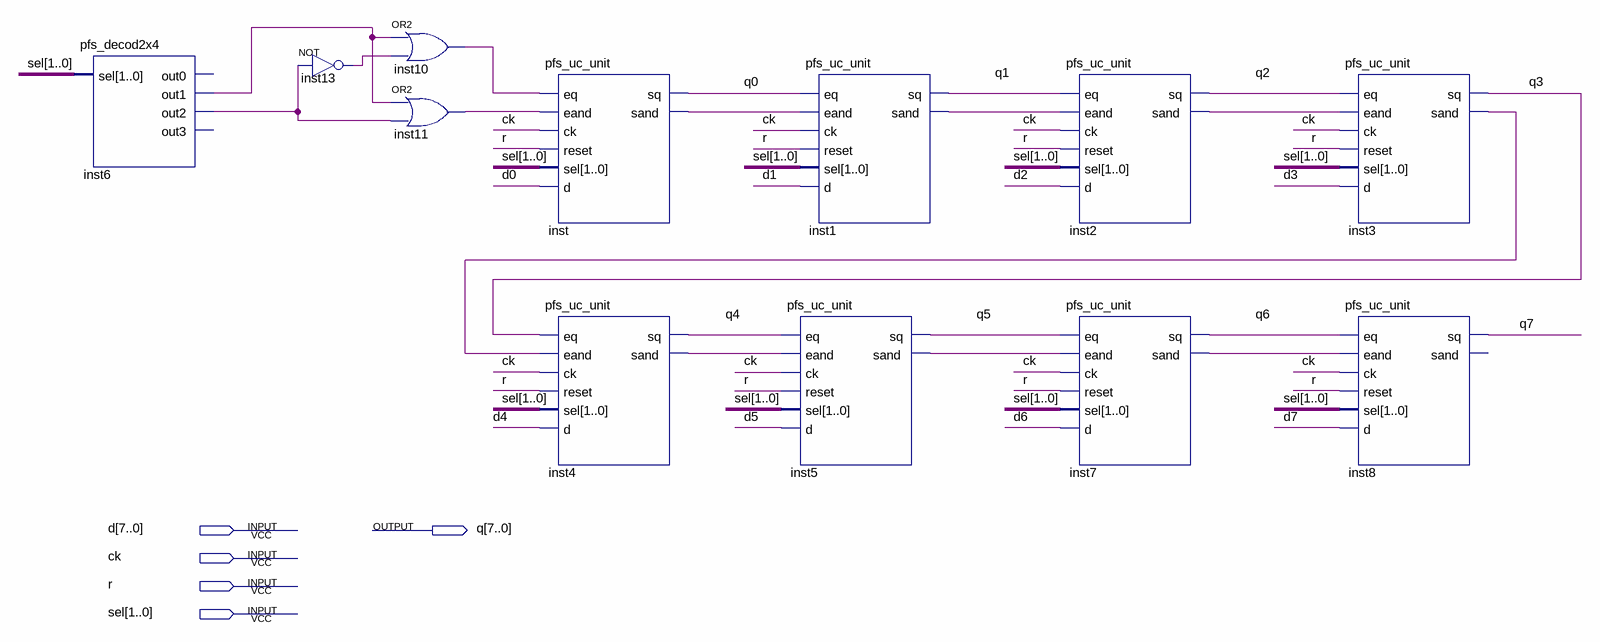
[diagram p0: schematic sheet]
// Quartus schematic pfs_gen_counter_8.bdf as structural Verilog: 12 symbols, 5 pins
module pfs_gen_counter_8 (
  input  [7:0] d,
  input  ck,
  input  r,
  input  [1:0] sel,
  output [7:0] q
);

  wire inst1_sand, inst2_sand, inst3_sand, inst4_sand, inst5_sand, inst6_out1, inst6_out2, inst7_sand,
       inst10_out, inst11_out, inst13_out, inst_sand;

  pfs_decod2x4 inst6 (.sel(sel), .out1(inst6_out1), .out2(inst6_out2));  // open: out0, out3
  not inst13 (inst13_out, inst6_out2);
  or inst10 (inst10_out, inst6_out1, inst13_out);
  or inst11 (inst11_out, inst6_out1, inst6_out2);
  pfs_uc_unit inst (
    .eq(inst10_out), .eand(inst11_out), .ck(ck), .reset(r), .sel(sel), .d(d[0]), .sq(q[0]), .sand(inst_sand));
  pfs_uc_unit inst4 (
    .eq(q[3]), .eand(inst3_sand), .ck(ck), .reset(r), .sel(sel), .d(d[4]), .sq(q[4]), .sand(inst4_sand));
  pfs_uc_unit inst1 (
    .eq(q[0]), .eand(inst_sand), .ck(ck), .reset(r), .sel(sel), .d(d[1]), .sq(q[1]), .sand(inst1_sand));
  pfs_uc_unit inst5 (
    .eq(q[4]), .eand(inst4_sand), .ck(ck), .reset(r), .sel(sel), .d(d[5]), .sq(q[5]), .sand(inst5_sand));
  pfs_uc_unit inst2 (
    .eq(q[1]), .eand(inst1_sand), .ck(ck), .reset(r), .sel(sel), .d(d[2]), .sq(q[2]), .sand(inst2_sand));
  pfs_uc_unit inst7 (
    .eq(q[5]), .eand(inst5_sand), .ck(ck), .reset(r), .sel(sel), .d(d[6]), .sq(q[6]), .sand(inst7_sand));
  pfs_uc_unit inst3 (
    .eq(q[2]), .eand(inst2_sand), .ck(ck), .reset(r), .sel(sel), .d(d[3]), .sq(q[3]), .sand(inst3_sand));
  pfs_uc_unit inst8 (.eq(q[6]), .eand(inst7_sand), .ck(ck), .reset(r), .sel(sel), .d(d[7]), .sq(q[7]));  // open: sand
endmodule
